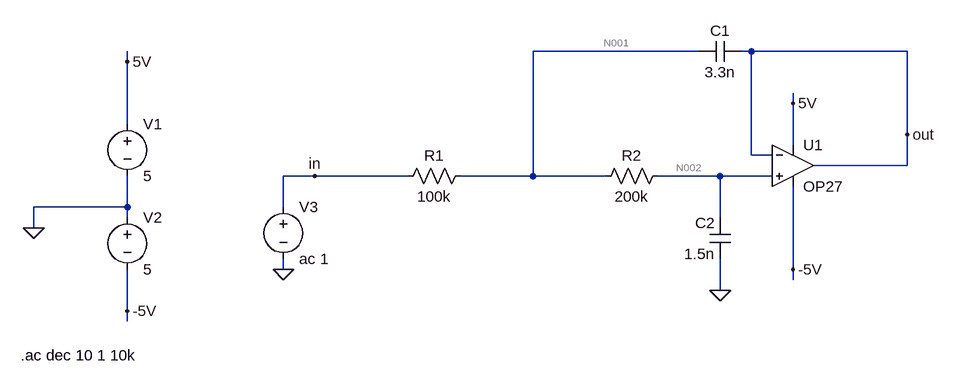
[diagram p0: schematic Draft1.asc]
Draft1.asc, the LTspice schematic file:
Version 4
SHEET 1 880 680
WIRE 464 -96 208 -96
WIRE 544 -96 528 -96
WIRE 784 -96 544 -96
WIRE -416 -80 -416 -96
WIRE 608 -16 608 -32
WIRE -416 16 -416 -80
WIRE 784 32 784 -96
WIRE 608 48 608 -16
WIRE 544 64 544 -96
WIRE 576 64 544 64
WIRE 784 80 784 32
WIRE 784 80 640 80
WIRE -128 96 -176 96
WIRE 16 96 -128 96
WIRE 208 96 208 -96
WIRE 208 96 96 96
WIRE 320 96 208 96
WIRE 496 96 400 96
WIRE 576 96 496 96
WIRE -416 144 -416 96
WIRE -416 144 -560 144
WIRE -176 144 -176 96
WIRE -416 160 -416 144
WIRE 496 160 496 96
WIRE -560 176 -560 144
WIRE -176 240 -176 224
WIRE 608 240 608 112
WIRE 608 256 608 240
WIRE 496 272 496 224
WIRE -416 304 -416 240
WIRE -416 320 -416 304
FLAG -560 176 0
FLAG 496 272 0
FLAG -176 240 0
FLAG -416 -80 5V
FLAG 608 -16 5V
FLAG -416 304 -5V
FLAG 608 240 -5V
FLAG 784 32 out
FLAG -128 96 in
SYMBOL res 112 80 R90
WINDOW 0 0 56 VBottom 2
WINDOW 3 32 56 VTop 2
SYMATTR InstName R1
SYMATTR Value 100k
SYMBOL res 416 80 R90
WINDOW 0 0 56 VBottom 2
WINDOW 3 32 56 VTop 2
SYMATTR InstName R2
SYMATTR Value 200k
SYMBOL cap 528 -112 R90
WINDOW 0 0 32 VBottom 2
WINDOW 3 32 32 VTop 2
SYMATTR InstName C1
SYMATTR Value 3.3n
SYMBOL cap 512 224 R180
WINDOW 0 24 56 Left 2
WINDOW 3 24 8 Left 2
SYMATTR InstName C2
SYMATTR Value 1.5n
SYMBOL voltage -416 0 R0
WINDOW 123 0 0 Left 0
WINDOW 39 0 0 Left 0
SYMATTR InstName V1
SYMATTR Value 5
SYMBOL voltage -416 144 R0
SYMATTR InstName V2
SYMATTR Value 5
SYMBOL voltage -176 128 R0
WINDOW 123 0 0 Left 0
WINDOW 39 0 0 Left 0
SYMATTR InstName V3
SYMATTR Value ac 1
SYMBOL Opamps\\OP27 608 16 R0
SYMATTR InstName U1
TEXT -580 372 Left 2 !.ac dec 10 1 10k

The netlist it stands for:
* Draft1.asc
R1 N001 in 100k
R2 N002 N001 200k
C1 out N001 3.3n
C2 0 N002 1.5n
V1 5V 0 5
V2 0 -5V 5
V3 in 0 ac 1
XU1 N002 out 5V -5V out OP27  ; pins In+ In- V+ V- OUT
.ac dec 10 1 10k
.lib ADI.lib
.backanno
.end

* Results of the author's LTspice run, read from the files saved beside the schematic
* Operating Point, zero values left out:
*   V(5v) = 5 V
*   V(-5v) = -5 V
*   I(V2) = -2.468 mA
*   I(V1) = -2.468 mA
*   Ix(u1:3) = 2.468 mA
*   Ix(u1:4) = -2.468 mA
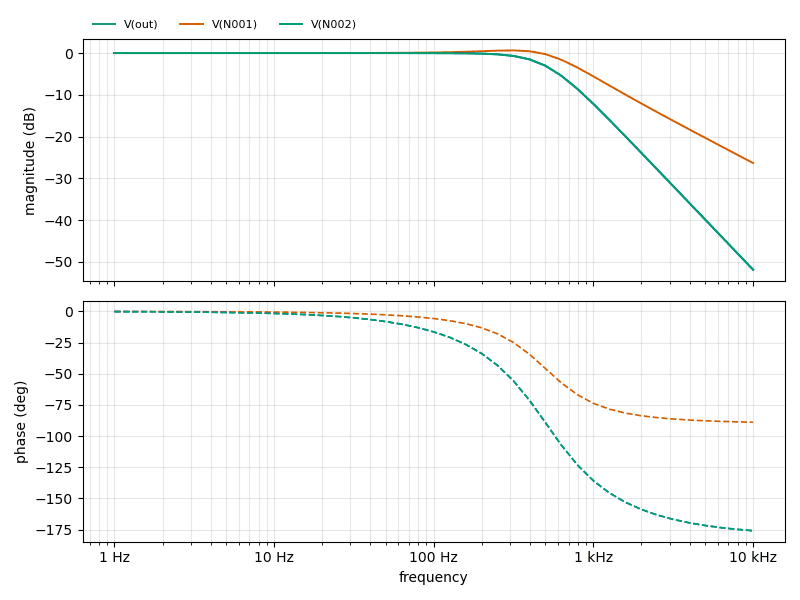
[diagram p1: AC Analysis of Draft1.asc, plotted from the saved traces]
* AC Analysis, 1 run:
*   V(out): -0.00 dB at 1 Hz, -51.86 dB at 10 kHz, peak -0.00 dB at 1 Hz, 3 dB below the peak at 498.6 Hz
*   V(N001): -0.00 dB at 1 Hz, -26.32 dB at 10 kHz, peak 0.63 dB at 316.2 Hz, 3 dB below the peak at 693.8 Hz
*   V(N002): -0.00 dB at 1 Hz, -51.86 dB at 10 kHz, peak -0.00 dB at 1 Hz, 3 dB below the peak at 498.6 Hz